# Altium schematic sheet Hoja_Master.SchDoc: Hoja_Master
size A4; SheetNumber: 1; SheetTotal: 6
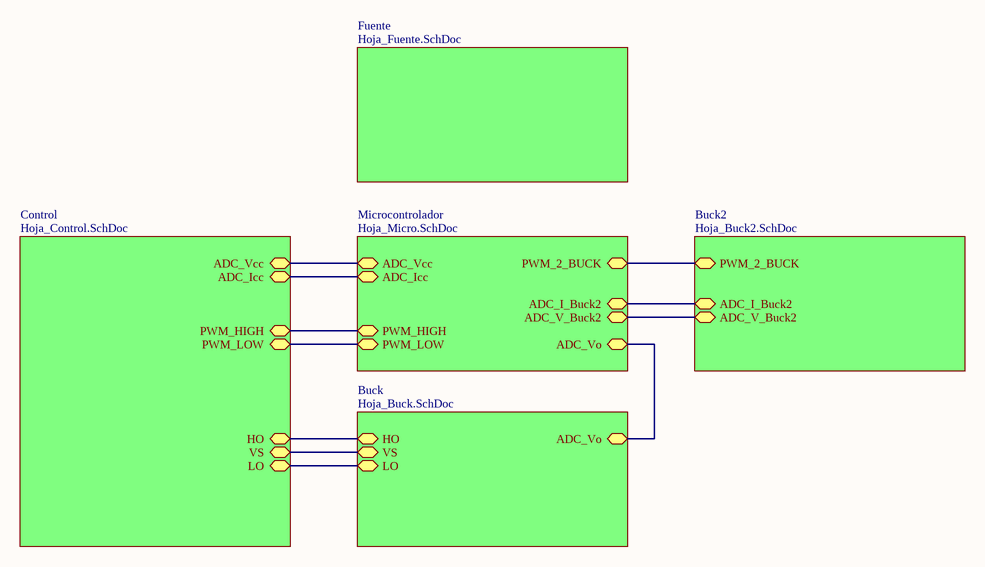
[diagram p0: Hoja_Master.SchDoc]

## Sub-sheets
Buck = Hoja_Buck.SchDoc: HO (bidir), LO (bidir), VS (bidir), ADC_Vo (bidir)
Buck2 = Hoja_Buck2.SchDoc: ADC_I_Buck2 (bidir), ADC_V_Buck2 (bidir), PWM_2_BUCK (bidir)
Control = Hoja_Control.SchDoc: ADC_Vcc (bidir), ADC_Icc (bidir), PWM_HIGH (bidir), HO (bidir), LO (bidir), VS (bidir), PWM_LOW (bidir)
Fuente = Hoja_Fuente.SchDoc: no entries
Microcontrolador = Hoja_Micro.SchDoc: ADC_Vcc (bidir), ADC_Icc (bidir), PWM_HIGH (bidir), PWM_LOW (bidir), ADC_I_Buck2 (bidir), ADC_V_Buck2 (bidir), ADC_Vo (bidir), PWM_2_BUCK (bidir)

## Nets
(unnamed): sheet Microcontrolador/ADC_Vcc, sheet Control/ADC_Vcc
(unnamed): sheet Microcontrolador/ADC_Icc, sheet Control/ADC_Icc
(unnamed): sheet Microcontrolador/PWM_HIGH, sheet Control/PWM_HIGH
(unnamed): sheet Microcontrolador/PWM_LOW, sheet Control/PWM_LOW
(unnamed): sheet Microcontrolador/ADC_I_Buck2, sheet Buck2/ADC_I_Buck2
(unnamed): sheet Microcontrolador/ADC_V_Buck2, sheet Buck2/ADC_V_Buck2
(unnamed): sheet Microcontrolador/ADC_Vo, sheet Buck/ADC_Vo
(unnamed): sheet Microcontrolador/PWM_2_BUCK, sheet Buck2/PWM_2_BUCK
(unnamed): sheet Buck/HO, sheet Control/HO
(unnamed): sheet Buck/LO, sheet Control/LO
(unnamed): sheet Buck/VS, sheet Control/VS

## Notes on the sheet
- Title:
- Size:
- Author:
- A4
- Sheet
- of
- Revision:
- File:
- Date: